# Altium project L-1K1W1007851A.PrjPcb
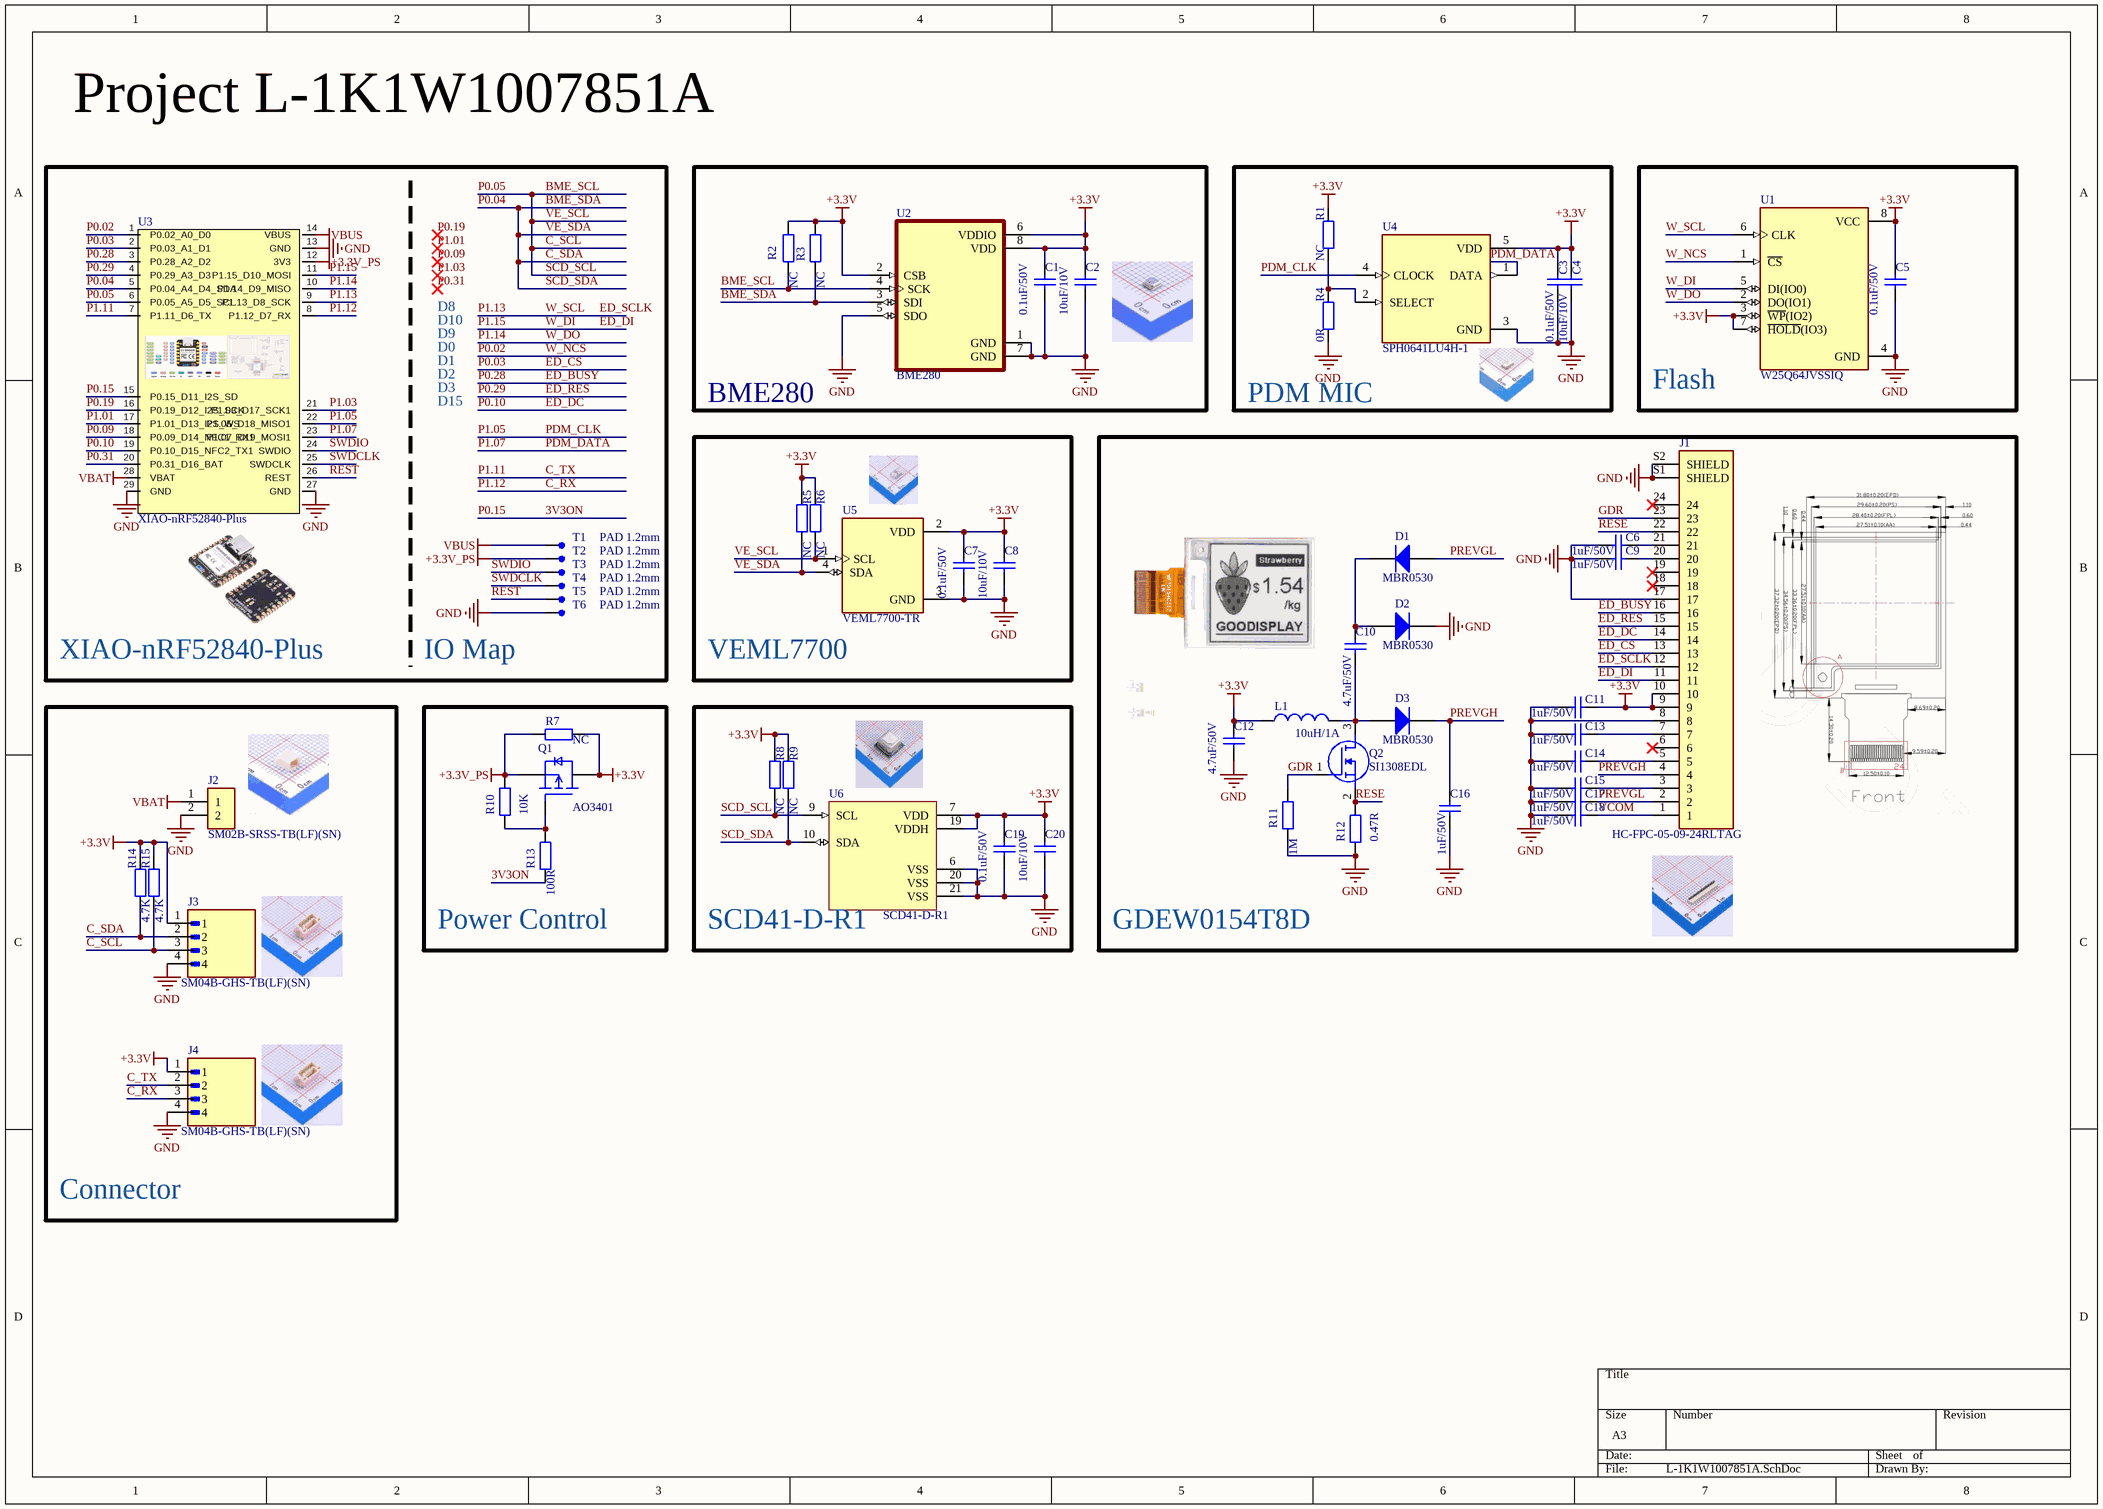
[diagram p0: L-1K1W1007851A.SchDoc]
1 sheet, 57 parts. Net scope: global (net labels, ports and power ports of the same name join across sheets).
Board file: L-1K1W1007851A.PcbDoc

## Sheet L-1K1W1007851A.SchDoc
size A3; SheetNumber: 1; SheetTotal: 1

### Parts
C1  0.1uF/50V  [C 0603]
C2  10uF/10V  [C 0603]
C3  0.1uF/50V  [C 0603]
C4  10uF/10V  [C 0603]
C5  0.1uF/50V  [C 0603]
C6  1uF/50V  [C 0603]
C7  0.1uF/50V  [C 0603]
C8  10uF/10V  [C 0603]
C9  1uF/50V  [C 0603]
C10  4.7uF/50V  [C 0805]
C11  1uF/50V  [C 0603]
C12  4.7uF/50V  [C 0805]
C13  1uF/50V  [C 0603]
C14  1uF/50V  [C 0603]
C15  1uF/50V  [C 0603]
C16  1uF/50V  [C 0603]
C17  1uF/50V  [C 0603]
C18  1uF/50V  [C 0603]
C19  0.1uF/50V  [C 0603]
C20  10uF/10V  [C 0603]
D1  MBR0530  [SOD-323]
D2  MBR0530  [SOD-323]
D3  MBR0530  [SOD-323]
J1  HC-FPC-05-09-24RLTAG  [GCT_FFC2B28-24-G]
J2  SM02B-SRSS-TB(LF)(SN)  [SM02B-SRSS-TB(LF)(SN)]
J3  SM04B-GHS-TB(LF)(SN)  [JST_SM04B-SRSS-TB(LF)(SN)]
J4  SM04B-GHS-TB(LF)(SN)  [JST_SM04B-SRSS-TB(LF)(SN)]
L1  10uH/1A  [CD31]
Q1  AO3401  [SOT23-3N]
Q2  SI1308EDL  [SOT323]
R1  NC  [R 0603]
R2  NC  [R 0603]
R3  NC  [R 0603]
R4  0R  [R 0603]
R5  NC  [R 0603]
R6  NC  [R 0603]
R7  NC  [R 0603]
R8  NC  [R 0603]
R9  NC  [R 0603]
R10  10K  [R 0603]
R11  1M  [R 0603]
R12  0.47R  [R 0603]
R13  100R  [R 0603]
R14  4.7K  [R 0603]
R15  4.7K  [R 0603]
T1  PAD 1.2mm  [TEST 1.2]
T2  PAD 1.2mm  [TEST 1.2]
T3  PAD 1.2mm  [TEST 1.2]
T4  PAD 1.2mm  [TEST 1.2]
T5  PAD 1.2mm  [TEST 1.2]
T6  PAD 1.2mm  [TEST 1.2]
U1  W25Q64JVSSIQ  [SOIC127P790X216-8N]
U2  BME280  [PSON65P250X250X100-8N]
U3  XIAO-nRF52840-Plus  [XIAO-nRF52840-Plus]
U4  SPH0641LU4H-1  [MIC_SPH0641LU4H-1]
U5  VEML7700-TR  [XDCR_VEML7700-TR]
U6  SCD41-D-R1  [SCD4x]

### Blocks framed on the sheet
BME280: C1 C2 R2 R3 U2
PDM MIC: C3 C4 R1 R4 U4
Flash: C5 U1
VEML7700: C7 C8 R5 R6 U5
GDEW0154T8D: C6 C9-C18 D1-D3 J1 L1 Q2 R11 R12
Connector: J2-J4 R14 R15
Power Control: Q1 R7 R10 R13
SCD41-D-R1: C19 C20 R8 R9 U6

### Nets
+3.3V: C1.2 C2.2 C3.2 C4.2 C5.2 C7.2 C8.2 C11.1 C12.2 C19.2 C20.2 J1.9 J1.10 J3.1 J4.1 L1.1 Q1.3(D) R1.1 R2.1 R3.1 R5.1 R6.1 R7.2 R8.1 R9.1 R14.1 R15.1 U1.3(~{WP}(IO2)) U1.7(~{HOLD}(IO3)) U1.8(VCC) U2.2(CSB) U2.6(VDDIO) U2.8(VDD) U4.5(VDD) U5.2(VDD) U6.7(VDD) U6.19(VDDH)
+3.3V_PS: Q1.2(S) R7.1 R10.1 T2.1 U3.12(3V3)
GND: C1.1 C2.1 C3.1 C4.1 C5.1 C6.2 C7.1 C8.1 C9.2 C11.2 C12.1 C13.2 C14.2 C15.2 C16.1 C17.2 C18.2 C19.1 C20.1 D2.2(K) J1.8 J1.17 J1.S1(SHIELD) J1.S2(SHIELD) J2.2 J3.4 J4.4 R4.2 R11.2 R12.2 T6.1 U1.4(GND) U2.1(GND) U2.5(SDO) U2.7(GND) U3.13(GND) U3.27(GND) U3.29(GND) U4.3(GND) U5.3(GND) U6.6(VSS) U6.20(VSS) U6.21(VSS)
VBAT: J2.1 U3.28(VBAT)
VBUS: T1.1 U3.14(VBUS)
3V3ON: R13.2 U3.15(P0.15_D11_I2S_SD)  [also labelled P0.15]
BME_SCL: J3.3 R2.2 R6.2 R8.2 R14.2 U2.4(SCK) U3.6(P0.05_A5_D5_SCL) U5.1(SCL) U6.9(SCL)  [also labelled C_SCL, P0.05, SCD_SCL, VE_SCL]
BME_SDA: J3.2 R3.2 R5.2 R9.2 R15.2 U2.3(SDI) U3.5(P0.04_A4_D4_SDA) U5.4(SDA) U6.10(SDA)  [also labelled C_SDA, P0.04, SCD_SDA, VE_SDA]
C_RX: J4.3 U3.8(P1.12_D7_RX)  [also labelled P1.12]
C_TX: J4.2 U3.7(P1.11_D6_TX)  [also labelled P1.11]
ED_BUSY: J1.16 U3.3(P0.28_A2_D2)  [also labelled P0.28]
ED_CS: J1.13 U3.2(P0.03_A1_D1)  [also labelled P0.03]
ED_DC: J1.14 U3.19(P0.10_D15_NFC2_TX1)  [also labelled P0.10]
ED_DI: J1.11 U1.5(DI(IO0)) U3.11(P1.15_D10_MOSI)  [also labelled P1.15, W_DI]
ED_RES: J1.15 U3.4(P0.29_A3_D3)  [also labelled P0.29]
ED_SCLK: J1.12 U1.6(CLK) U3.9(P1.13_D8_SCK)  [also labelled P1.13, W_SCL]
GDR: J1.23 Q2.1(G) R11.1
P0.02: U1.1(~{CS}) U3.1(P0.02_A0_D0)  [also labelled W_NCS]
P0.09: U3.18(P0.09_D14_NFC1_RX1)
P0.19: U3.16(P0.19_D12_I2S_SCK)
P0.31: U3.20(P0.31_D16_BAT)
P1.01: U3.17(P1.01_D13_I2S_WS)
P1.03: U3.21(P1.03_D17_SCK1)
P1.05: U3.22(P1.05_D18_MISO1) U4.4(CLOCK)  [also labelled PDM_CLK]
P1.07: U3.23(P1.07_D19_MOSI1) U4.1(DATA)  [also labelled PDM_DATA]
P1.14: U1.2(DO(IO1)) U3.10(P1.14_D9_MISO)  [also labelled W_DO]
PREVGH: C16.2 D3.2(K) J1.4
PREVGL: C17.1 D1.1(A) J1.2
RESE: J1.22 Q2.2(S) R12.1
REST: T5.1 U3.26(REST)
SWDCLK: T4.1 U3.25(SWDCLK)
SWDIO: T3.1 U3.24(SWDIO)
VCOM: C18.1 J1.1
NetC6_1: C6.1 J1.21
NetC9_1: C9.1 J1.20
NetC10_1: C10.1 D3.1(A) L1.2 Q2.3(D)
NetC10_2: C10.2 D1.2(K) D2.1(A)
NetC13_1: C13.1 J1.7
NetC14_1: C14.1 J1.5
NetC15_1: C15.1 J1.3
NetQ1_1: Q1.1(G) R10.2 R13.1
NetR1_2: R1.2 R4.1 U4.2(SELECT)

Not connected (* = marked no-connect by the designer): J1 6* 18* 19* 24*

### Notes on the sheet
- Project L-1K1W1007851A
- D8
- D10
- D9
- D0
- D1
- D2
- D3
- D15
- XIAO-nRF52840-Plus
- IO Map
- Labels drawn without touching a wire or pin: P0.09, P0.19, P0.31, P1.01, P1.03

### Library data of the parts
C1-C20 = CAP: Value: 30pF
D1-D3 = D 1N4148: High Conductance Fast Diode; Published: 8-Jun-2000; LatestRevisionDate: 17-Jul-2002; LatestRevisionNote: Re-released for DXP Platform.; DatasheetVersion: 1997; PackageReference: DO-35; Publisher: Altium Limited; PackageDescription: Diode, Axial; Body 3.8 x 1.9 mm (LxDia. max), Lead Dia. 0.53 mm (max); Code_JEDEC: DO-204-AH; ComponentLink1Description: Manufacturer Link; ComponentLink1URL: http://www.fairchildsemi.com/; ComponentLink2Description: Datasheet; ComponentLink2URL: http://www.fairchildsemi.com/ds/1N%2F1N4148.pdf
J1 = FFC2B28-24-G: 24 Position FFC, FPC Connector Contacts, Top and Bottom 0.020 (0.50mm) Surface Mount, Right Angle; MF: Global Connector Technology; SnapEDA_Link: https://www.snapeda.com/parts/FFC2B28-24-G/Global+Connector+Technology/view-part/?ref=snap; Package: None; Value: *; MP: FFC2B28-24-G; Check_prices: https://www.snapeda.com/parts/FFC2B28-24-G/Global+Connector+Technology/view-part/?ref=eda
J2 = SM02B-SRSS-TB(LF)(SN): Connector Header Surface Mount, Right Angle 2 position 0.039 (1.00mm); MF: JST Sales; SnapEDA_Link: https://www.snapeda.com/parts/SM02B-SRSS-TB(LF)(SN)/JST/view-part/?ref=snap; Package: None; Value: *; MP: SM02B-SRSS-TB(LF)(SN); Check_prices: https://www.snapeda.com/parts/SM02B-SRSS-TB(LF)(SN)/JST/view-part/?ref=eda
J3 J4 = SM04B-GHS-TB(LF)(SN): Connector Header Surface Mount, Right Angle 4 position 0.049 (1.25mm); MF: JST Sales America Inc.; SnapEDA_Link: https://www.snapeda.com/parts/SM04B-GHS-TB(LF)(SN)/JST/view-part/?ref=snap; Package: None; Value: *; MP: SM04B-GHS-TB(LF)(SN); Check_prices: https://www.snapeda.com/parts/SM04B-GHS-TB(LF)(SN)/JST/view-part/?ref=eda
L1 = INDUCTOR
Q1 = AO3401: P-Channel 30 V 4A (Ta) 1.4W (Ta) Surface Mount SOT-23-3; MF: Alpha & Omega Semiconductor; SnapEDA_Link: https://www.snapeda.com/parts/AO3401/Alpha/view-part/?ref=snap; Package: SOT-23-3 Alpha &amp; Omega Semiconductor; Value: *; MP: AO3401; Check_prices: https://www.snapeda.com/parts/AO3401/Alpha/view-part/?ref=eda
Q2 = AO3400: N-Channel 30 V 5.8A (Ta) 1.4W (Ta) Surface Mount SOT-23-3; MF: Alpha &; SnapEDA_Link: https://www.snapeda.com/parts/AO3400/Alpha+%2526+Omega+Semiconductor+Inc./view-part/?ref=snap; Package: SOT-23-3 Alpha &amp; Omega Semiconductor; Value: *; MP: AO3400; Check_prices: https://www.snapeda.com/parts/AO3400/Alpha+%2526+Omega+Semiconductor+Inc./view-part/?ref=eda
R1-R15 = RES2: Resistor; Published: 8-Jun-2000; LatestRevisionDate: 17-Jul-2002; LatestRevisionNote: Re-released for DXP Platform.; PackageReference: AXIAL-0.3; Publisher: Altium Limited; PackageDescription: Axial Device, Thru-Hole; 2 Leads; 0.3 in Pin Spacing
T1-T6 = TEST
U1 = W25Q64BVSSIG: FLASH - NOR Memory IC 64Mb (8M x 8) SPI 80 MHz 8-SOIC; MF: Winbond Electronics; SnapEDA_Link: https://www.snapeda.com/parts/W25Q64BVSSIG/Winbond/view-part/?ref=snap; Package: SOIC-8 Winbond; Value: *; MP: W25Q64BVSSIG; Check_prices: https://www.snapeda.com/parts/W25Q64BVSSIG/Winbond/view-part/?ref=eda
U2 = BME280: DIGITAL HUMIDITY, PRESSURE AND TEMPERATURE SENSOR<br>* Digital interface IÂ²C (up to 3.4 MHz) and SPI (3 and 4 wire, up to 10 MHz)* Supply voltage VDD main supply voltage range: 1.71 V to 3.6 V*VDDIO interface voltage range: 1.2 V to 3.6 V<br> Operating range -40â€¦+85 Â°C, 0â€¦100 % rel. humidity, 300â€¦1100 hPa <br><br>  The library has been designed by<a href="https://www.facebook.com/groups/eaglecadsoftUK"> Richard Magdycz</a>; Package: None; Availability: Unavailable; MP: BME280; Value: *; Price: None
U4 = SPH0641LU4H-1: 100 Hz ~ 80 kHz Digital, PDM Microphone MEMS (Silicon) 1.62 V ~ 3.6 V Omnidirectional (-26dB Â±1dB @ 94dB SPL) Solder Pads; MF: Knowles; Availability: In Stock; Check_prices: https://www.snapeda.com/parts/SPH0641LU4H-1/Knowles/view-part/?ref=eda; SnapEDA_Link: https://www.snapeda.com/parts/SPH0641LU4H-1/Knowles/view-part/?ref=snap; Value: *; Price: None; Purchase-URL: https://pricing.snapeda.com/search/part/SPH0641LU4H-1/?ref=eda; Package: None; MP: SPH0641LU4H-1
U5 = VEML7700-TR: Optical Sensor Ambient 545nm I2C 4-SMD, J-Lead; MF: Vishay; SnapEDA_Link: https://www.snapeda.com/parts/VEML7700-TR/Vishay+Semiconductor+Opto+Division/view-part/?ref=snap; Package: Package; Value: *; MP: VEML7700-TR; Check_prices: https://www.snapeda.com/parts/VEML7700-TR/Vishay+Semiconductor+Opto+Division/view-part/?ref=eda
U6 = SCD4x